# Altium schematic sheet ClockDivider.SchDoc: LiveDesign Evaluation - Countdown
size A4; Organization: Altium Limited; Address1: L3, 12a Rodborough Rd; Address2: Frenchs Forest; Address3: NSW; Address4: Australia 2086; DocumentNumber: 6; SheetNumber: 6; SheetTotal: 11
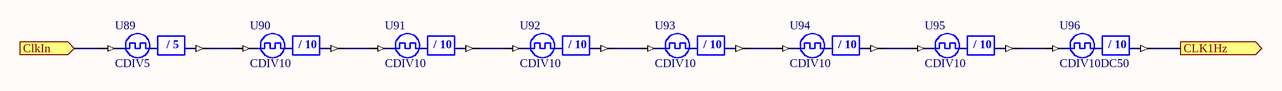
[diagram p0: ClockDivider.SchDoc]

## Parts
U89  CDIV5
U90  CDIV10
U91  CDIV10
U92  CDIV10
U93  CDIV10
U94  CDIV10
U95  CDIV10
U96  CDIV10DC50

## Ports
CLK1Hz (out), ClkIn (in)

## Nets
CLK1Hz: U96.CLKDV ; port CLK1Hz
ClkIn: U89.CLKIN ; port ClkIn
NetU89_CLKDV: U89.CLKDV U90.CLKIN
NetU90_CLKDV: U90.CLKDV U91.CLKIN
NetU91_CLKDV: U91.CLKDV U92.CLKIN
NetU92_CLKDV: U92.CLKDV U93.CLKIN
NetU93_CLKDV: U93.CLKDV U94.CLKIN
NetU94_CLKDV: U94.CLKDV U95.CLKIN
NetU95_CLKDV: U95.CLKDV U96.CLKIN

## Notes on the sheet
- Title
- Size:
- Date:
- A4
- Number:
- Time:
- Revision:
- Sheet
- of
- File:
- (in symbol CDIV5) / 5
- (in symbol CDIV10) / 10
- (in symbol CDIV10DC50) / 10

## Library data of the parts
U89 = CDIV5: Clock Divider by 5; ArchiveName: GENERIC; VHDLIB_SIM: GENERIC_LIB; Published: 29-Jan-2004; Publisher: Altium Limited; Core Revision: 1.00.00
U90-U95 = CDIV10: Clock Divider by 10; ArchiveName: GENERIC; VHDLIB_SIM: GENERIC_LIB; Published: 29-Jan-2004; Publisher: Altium Limited; Core Revision: 1.00.00
U96 = CDIV10DC50: Clock Divider by 10 with 50% Duty Cycle Output; ArchiveName: GENERIC; VHDLIB_SIM: GENERIC_LIB; Xilinx Equivalent: CLK_DIV10; Published: 29-Jan-2004; Publisher: Altium Limited; Core Revision: 1.00.00